# EAGLE schematic alu4 (EAGLE 7.6.0)
ALU

## Sheet 1 of 10: Accum Reg
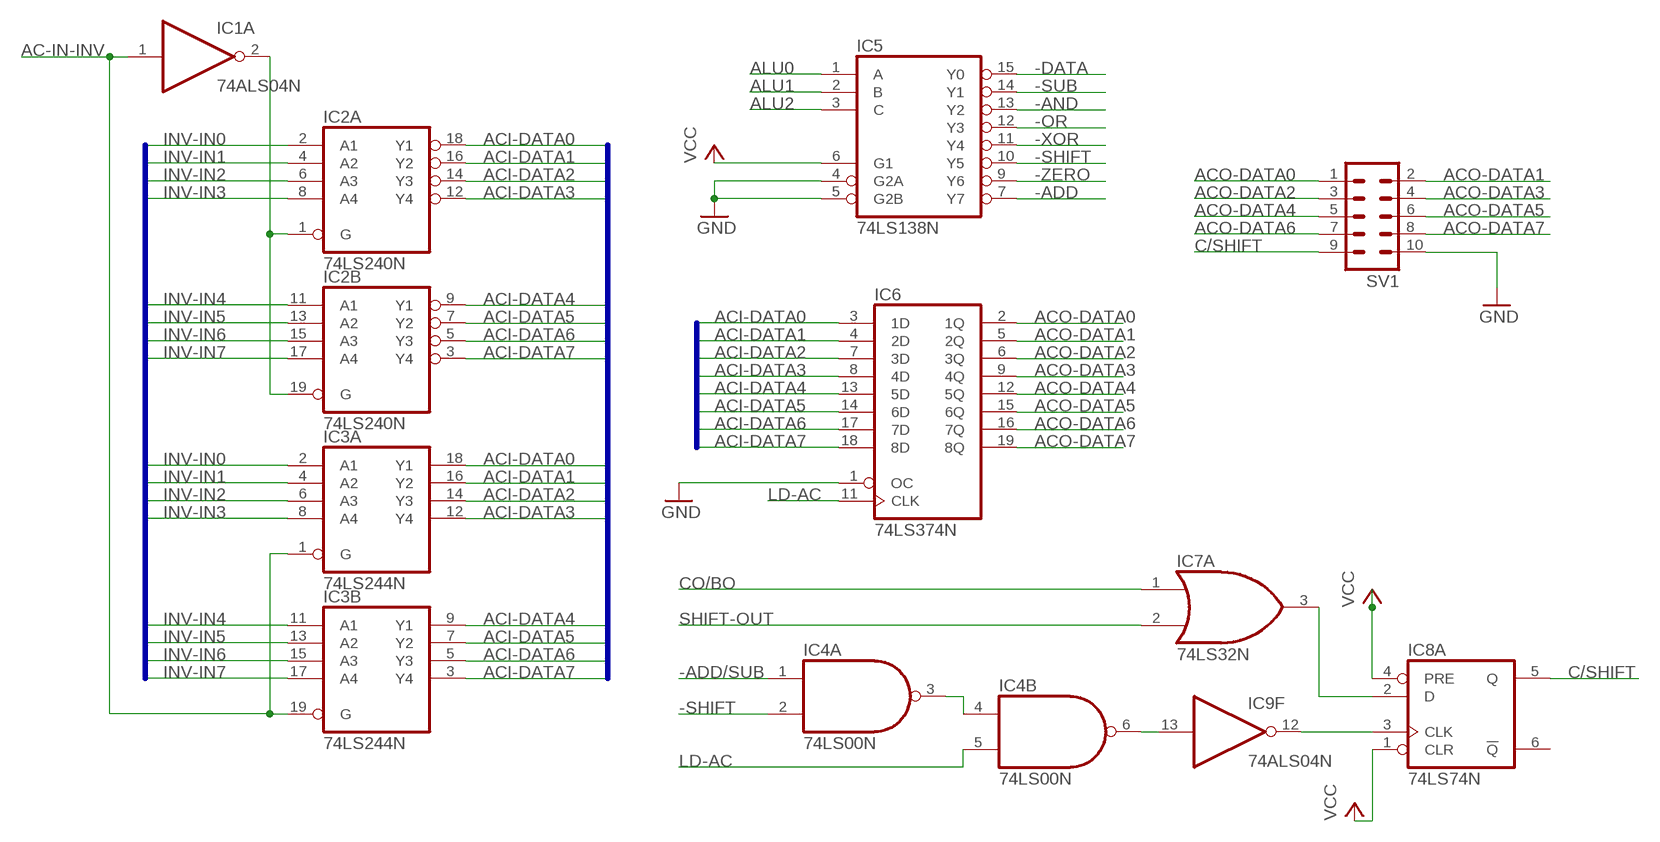
[diagram p0: schematic, sheet 1]

### Parts
IC1  74ALS04N  [DIL14]
IC2  74LS240N  [DIL20]
IC3  74LS244N  [DIL20]
IC4  74LS00N  [DIL14]
IC5  74LS138N  [DIL16]
IC6  74LS374N  [DIL20]
IC7  74LS32N  [DIL14]
IC8  74LS74N  [DIL14]
IC9  74ALS04N  [DIL14]
SV1  MA05-2  [MA05-2]

### Nets
-ADD: IC5.7(Y7) ; also sheet 8
-ADD/SUB: IC4.1(A:I0) ; also sheet 8
-AND: IC5.13(Y2) ; also sheet 5
-DATA: IC5.15(Y0) ; also sheet 4
-OR: IC5.12(Y3) ; also sheet 5
-SHIFT: IC4.2(A:I1) IC5.10(Y5) ; also sheet 7
-SUB: IC5.14(Y1) ; also sheet 8
-XOR: IC5.11(Y4) ; also sheet 5
-ZERO: IC5.9(Y6) ; also sheet 5
AC-IN-INV: IC1.1(A:I) IC3.1(A:G) IC3.19(B:G) ; also sheet 6,9
ACI-DATA0: IC2.18(A:Y1) IC3.18(A:Y1) IC6.3(1D)
ACI-DATA1: IC2.16(A:Y2) IC3.16(A:Y2) IC6.4(2D)
ACI-DATA2: IC2.14(A:Y3) IC3.14(A:Y3) IC6.7(3D)
ACI-DATA3: IC2.12(A:Y4) IC3.12(A:Y4) IC6.8(4D)
ACI-DATA4: IC2.9(B:Y1) IC3.9(B:Y1) IC6.13(5D)
ACI-DATA5: IC2.7(B:Y2) IC3.7(B:Y2) IC6.14(6D)
ACI-DATA6: IC2.5(B:Y3) IC3.5(B:Y3) IC6.17(7D)
ACI-DATA7: IC2.3(B:Y4) IC3.3(B:Y4) IC6.18(8D)
ACO-DATA0: IC6.2(1Q) SV1.1 ; also sheet 4,5,6,7,8
ACO-DATA1: IC6.5(2Q) SV1.2 ; also sheet 4,5,6,7,8
ACO-DATA2: IC6.6(3Q) SV1.3 ; also sheet 4,5,6,7,8
ACO-DATA3: IC6.9(4Q) SV1.4 ; also sheet 4,5,6,7,8
ACO-DATA4: IC6.12(5Q) SV1.5 ; also sheet 4,5,6,7,8
ACO-DATA5: IC6.15(6Q) SV1.6 ; also sheet 4,5,6,7,8
ACO-DATA6: IC6.16(7Q) SV1.7 ; also sheet 4,5,6,7,8
ACO-DATA7: IC6.19(8Q) SV1.8 ; also sheet 4,5,6,7,8
ALU0: IC5.1(A) ; also sheet 6,7,9
ALU1: IC5.2(B) ; also sheet 6,7,9
ALU2: IC5.3(C) ; also sheet 6,7,9
C/SHIFT: IC8.5(A:Q) SV1.9 ; also sheet 6,7,8
CO/BO: IC7.1(A:I0) ; also sheet 8
GND: IC5.4(G2A) IC5.5(G2B) IC6.1(OC) SV1.10 ; also sheet 2,5,6,7,9,10
INV-IN0: IC2.2(A:A1) IC3.2(A:A1) ; also sheet 4,5,7,8
INV-IN1: IC2.4(A:A2) IC3.4(A:A2) ; also sheet 4,5,7,8
INV-IN2: IC2.6(A:A3) IC3.6(A:A3) ; also sheet 4,5,7,8
INV-IN3: IC2.8(A:A4) IC3.8(A:A4) ; also sheet 4,5,7,8
INV-IN4: IC2.11(B:A1) IC3.11(B:A1) ; also sheet 4,5,7,8
INV-IN5: IC2.13(B:A2) IC3.13(B:A2) ; also sheet 4,5,7,8
INV-IN6: IC2.15(B:A3) IC3.15(B:A3) ; also sheet 4,5,7,8
INV-IN7: IC2.17(B:A4) IC3.17(B:A4) ; also sheet 4,5,7,8
LD-AC: IC4.5(B:I1) IC6.11(CLK) ; also sheet 9
N$3: IC4.3(A:O) IC4.4(B:I0)
N$4: IC4.6(B:O) IC9.13(F:I)
N$5: IC8.3(A:CLK) IC9.12(F:O)
N$7: IC7.3(A:O) IC8.2(A:D)
N$42: IC1.2(A:O) IC2.1(A:G) IC2.19(B:G)
SHIFT-OUT: IC7.2(A:I1) ; also sheet 7
VCC: IC5.6(G1) IC8.1(A:CLR) IC8.4(A:PRE) ; also sheet 2,6,7,9
Unconnected: IC8.6(A:!Q)

### Buses
INV-IN[0..7]
ACI-DATA[0..7]

## Sheet 2 of 10: caps & pullups
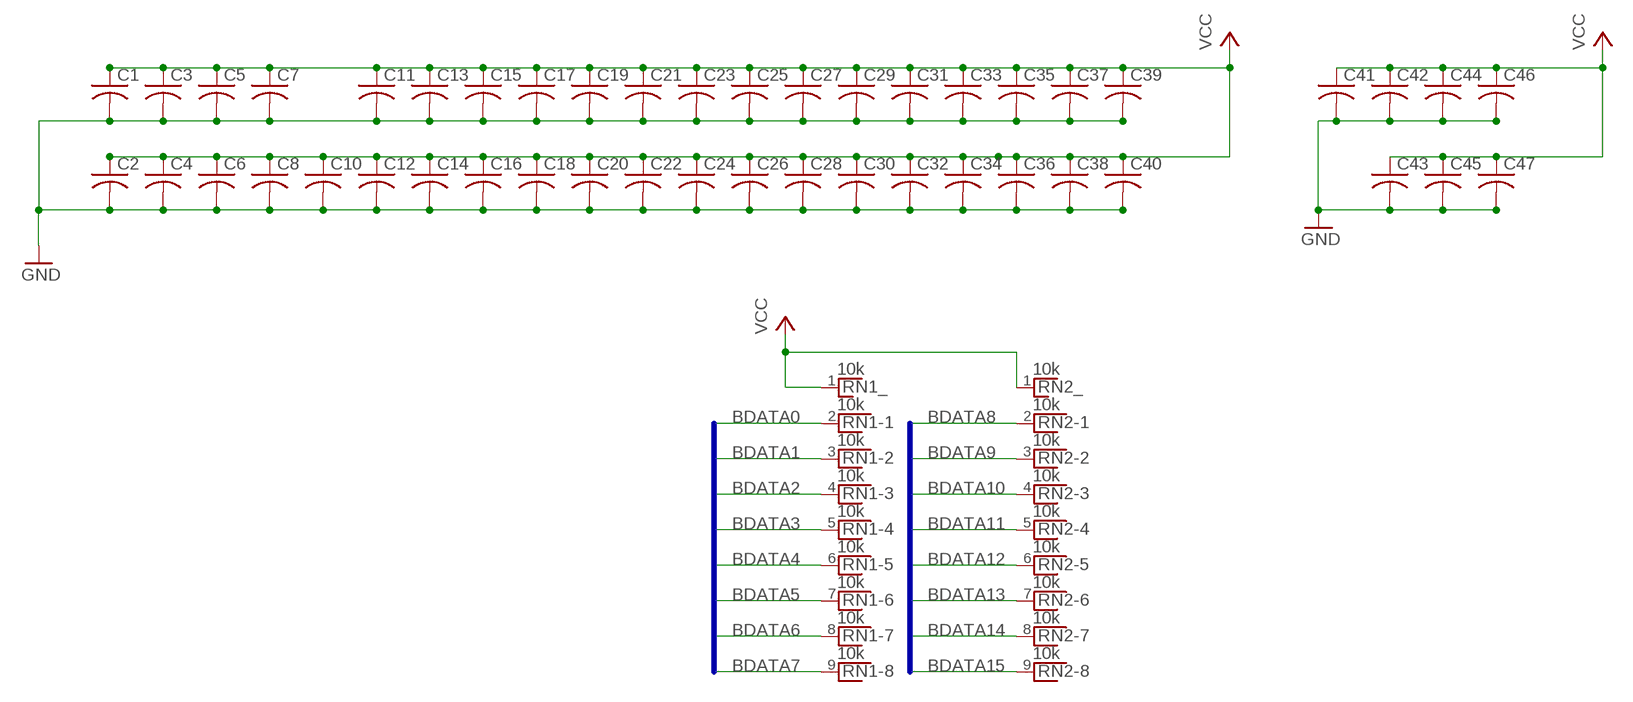
[diagram p1: schematic, sheet 2]

### Parts
C1  C-US025-024X044  [C025-024X044]
C2  C-US025-024X044  [C025-024X044]
C3  C-US025-024X044  [C025-024X044]
C4  C-US025-024X044  [C025-024X044]
C5  C-US025-024X044  [C025-024X044]
C6  C-US025-024X044  [C025-024X044]
C7  C-US025-024X044  [C025-024X044]
C8  C-US025-024X044  [C025-024X044]
C10  C-US025-024X044  [C025-024X044]
C11  C-US025-024X044  [C025-024X044]
C12  C-US025-024X044  [C025-024X044]
C13  C-US025-024X044  [C025-024X044]
C14  C-US025-024X044  [C025-024X044]
C15  C-US025-024X044  [C025-024X044]
C16  C-US025-024X044  [C025-024X044]
C17  C-US025-024X044  [C025-024X044]
C18  C-US025-024X044  [C025-024X044]
C19  C-US025-024X044  [C025-024X044]
C20  C-US025-024X044  [C025-024X044]
C21  C-US025-024X044  [C025-024X044]
C22  C-US025-024X044  [C025-024X044]
C23  C-US025-024X044  [C025-024X044]
C24  C-US025-024X044  [C025-024X044]
C25  C-US025-024X044  [C025-024X044]
C26  C-US025-024X044  [C025-024X044]
C27  C-US025-024X044  [C025-024X044]
C28  C-US025-024X044  [C025-024X044]
C29  C-US025-024X044  [C025-024X044]
C30  C-US025-024X044  [C025-024X044]
C31  C-US025-024X044  [C025-024X044]
C32  C-US025-024X044  [C025-024X044]
C33  C-US025-024X044  [C025-024X044]
C34  C-US025-024X044  [C025-024X044]
C35  C-US025-024X044  [C025-024X044]
C36  C-US025-024X044  [C025-024X044]
C37  C-US025-024X044  [C025-024X044]
C38  C-US025-024X044  [C025-024X044]
C39  C-US025-024X044  [C025-024X044]
C40  C-US025-024X044  [C025-024X044]
C41  C-US025-024X044  [C025-024X044]
C42  C-US025-024X044  [C025-024X044]
C43  C-US025-024X044  [C025-024X044]
C44  C-US025-024X044  [C025-024X044]
C45  C-US025-024X044  [C025-024X044]
C46  C-US025-024X044  [C025-024X044]
C47  C-US025-024X044  [C025-024X044]
RN1  10k  RNX8  [RN-9]
RN2  10k  RNX8  [RN-9]

### Nets
BDATA0: RN1.2 ; also sheet 3,4,5,6,8
BDATA1: RN1.3 ; also sheet 3,4,5,6,8
BDATA2: RN1.4 ; also sheet 3,4,5,6,8
BDATA3: RN1.5 ; also sheet 3,4,5,6,8
BDATA4: RN1.6 ; also sheet 3,4,5,6,8
BDATA5: RN1.7 ; also sheet 3,4,5,6,8
BDATA6: RN1.8 ; also sheet 3,4,5,6,8
BDATA7: RN1.9 ; also sheet 3,4,5,6,8
BDATA8: RN2.2 ; also sheet 3,4,6
BDATA9: RN2.3 ; also sheet 3,4,6
BDATA10: RN2.4 ; also sheet 3,4,6
BDATA11: RN2.5 ; also sheet 3,4,6
BDATA12: RN2.6 ; also sheet 3,4,6
BDATA13: RN2.7 ; also sheet 3,4,6
BDATA14: RN2.8 ; also sheet 3,4,6
BDATA15: RN2.9 ; also sheet 3,4,6
GND: C1.2 C2.2 C3.2 C4.2 C5.2 C6.2 C7.2 C8.2 C10.2 C11.2 C12.2 C13.2 C14.2 C15.2 C16.2 C17.2 C18.2 C19.2 C20.2 C21.2 C22.2 C23.2 C24.2 C25.2 C26.2 C27.2 C28.2 C29.2 C30.2 C31.2 C32.2 C33.2 C34.2 C35.2 C36.2 C37.2 C38.2 C39.2 C40.2 C41.2 C42.2 C43.2 C44.2 C45.2 C46.2 C47.2 ; also sheet 1,5,6,7,9,10
VCC: C1.1 C2.1 C3.1 C4.1 C5.1 C6.1 C7.1 C8.1 C10.1 C11.1 C12.1 C13.1 C14.1 C15.1 C16.1 C17.1 C18.1 C19.1 C20.1 C21.1 C22.1 C23.1 C24.1 C25.1 C26.1 C27.1 C28.1 C29.1 C30.1 C31.1 C32.1 C33.1 C34.1 C35.1 C36.1 C37.1 C38.1 C39.1 C40.1 C41.1 C42.1 C43.1 C44.1 C45.1 C46.1 C47.1 RN1.1 RN2.1 ; also sheet 1,6,7,9

### Buses
BDATA[0..15]

## Sheet 3 of 10: Reg INC/DEC
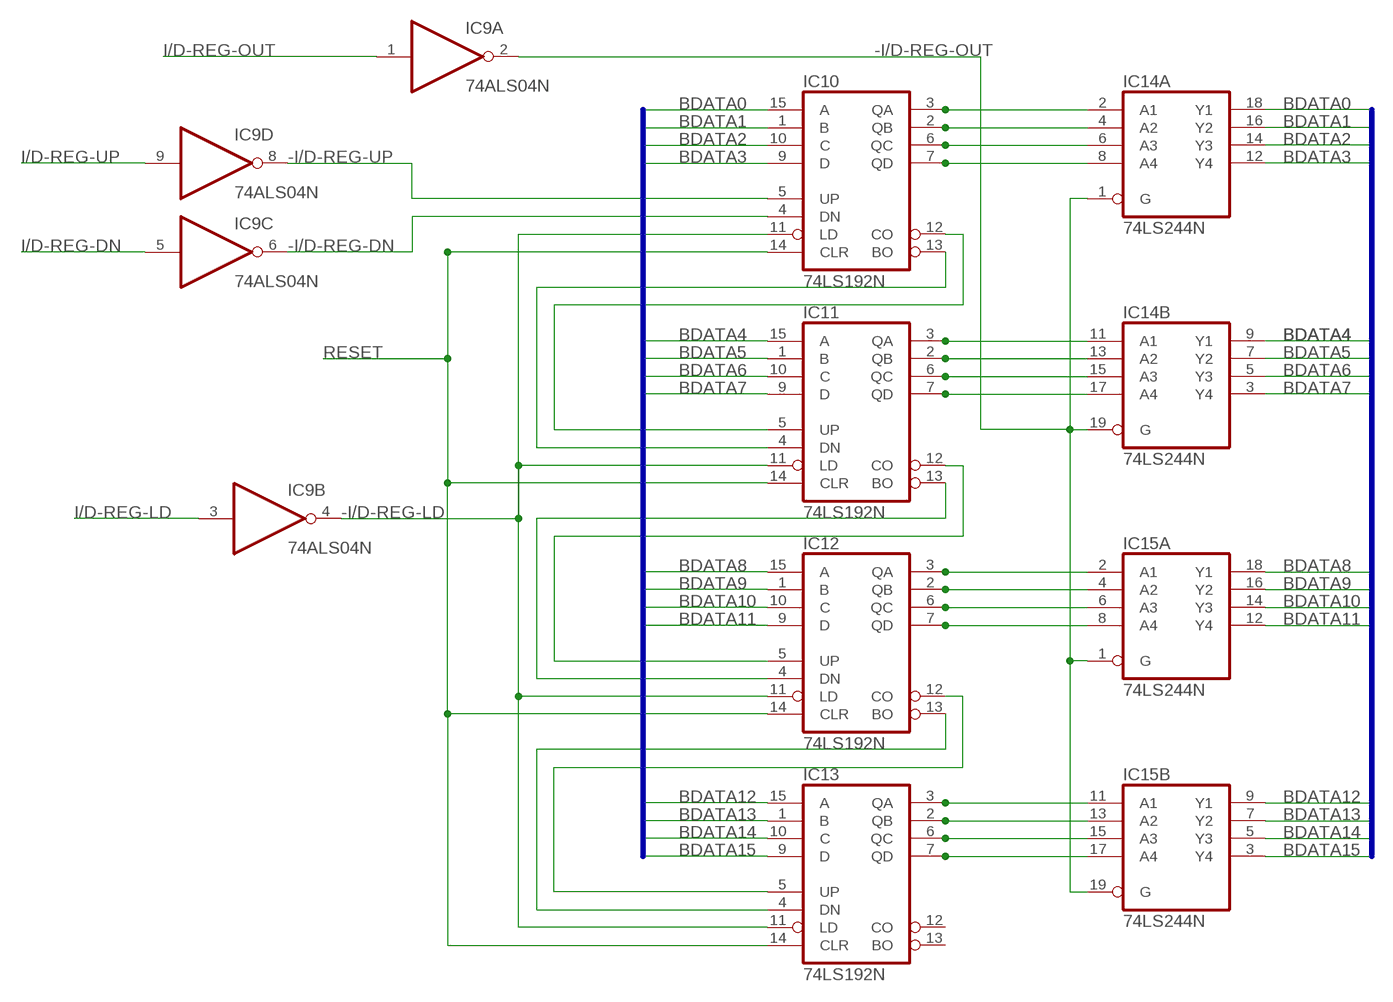
[diagram p2: schematic, sheet 3]

### Parts
IC10  74LS192N  [DIL16]
IC11  74LS192N  [DIL16]
IC12  74LS192N  [DIL16]
IC13  74LS192N  [DIL16]
IC14  74LS244N  [DIL20]
IC15  74LS244N  [DIL20]

### Nets
-I/D-REG-DN: IC9.6(C:O) IC10.4(DN)
-I/D-REG-LD: IC9.4(B:O) IC10.11(LD) IC11.11(LD) IC12.11(LD) IC13.11(LD)
-I/D-REG-OUT: IC9.2(A:O) IC14.1(A:G) IC14.19(B:G) IC15.1(A:G) IC15.19(B:G)
-I/D-REG-UP: IC9.8(D:O) IC10.5(UP)
BDATA0: IC10.15(A) IC14.18(A:Y1) ; also sheet 2,4,5,6,8
BDATA1: IC10.1(B) IC14.16(A:Y2) ; also sheet 2,4,5,6,8
BDATA2: IC10.10(C) IC14.14(A:Y3) ; also sheet 2,4,5,6,8
BDATA3: IC10.9(D) IC14.12(A:Y4) ; also sheet 2,4,5,6,8
BDATA4: IC11.15(A) IC14.9(B:Y1) ; also sheet 2,4,5,6,8
BDATA5: IC11.1(B) IC14.7(B:Y2) ; also sheet 2,4,5,6,8
BDATA6: IC11.10(C) IC14.5(B:Y3) ; also sheet 2,4,5,6,8
BDATA7: IC11.9(D) IC14.3(B:Y4) ; also sheet 2,4,5,6,8
BDATA8: IC12.15(A) IC15.18(A:Y1) ; also sheet 2,4,6
BDATA9: IC12.1(B) IC15.16(A:Y2) ; also sheet 2,4,6
BDATA10: IC12.10(C) IC15.14(A:Y3) ; also sheet 2,4,6
BDATA11: IC12.9(D) IC15.12(A:Y4) ; also sheet 2,4,6
BDATA12: IC13.15(A) IC15.9(B:Y1) ; also sheet 2,4,6
BDATA13: IC13.1(B) IC15.7(B:Y2) ; also sheet 2,4,6
BDATA14: IC13.10(C) IC15.5(B:Y3) ; also sheet 2,4,6
BDATA15: IC13.9(D) IC15.3(B:Y4) ; also sheet 2,4,6
I/D-REG-DN: IC9.5(C:I) ; also sheet 9
I/D-REG-LD: IC9.3(B:I) ; also sheet 9
I/D-REG-OUT: IC9.1(A:I) ; also sheet 4,9
I/D-REG-UP: IC9.9(D:I) ; also sheet 9
N$58: IC10.13(BO) IC11.4(DN)
N$59: IC10.12(CO) IC11.5(UP)
N$60: IC11.13(BO) IC12.4(DN)
N$61: IC11.12(CO) IC12.5(UP)
N$62: IC12.13(BO) IC13.4(DN)
N$63: IC12.12(CO) IC13.5(UP)
R1D0: IC10.7(QD) IC14.8(A:A4)
R1D1: IC10.6(QC) IC14.6(A:A3)
R1D2: IC10.2(QB) IC14.4(A:A2)
R1D3: IC10.3(QA) IC14.2(A:A1)
R1D4: IC11.7(QD) IC14.17(B:A4)
R1D5: IC11.6(QC) IC14.15(B:A3)
R1D6: IC11.2(QB) IC14.13(B:A2)
R1D7: IC11.3(QA) IC14.11(B:A1)
R1D8: IC12.7(QD) IC15.8(A:A4)
R1D9: IC12.6(QC) IC15.6(A:A3)
R1D10: IC12.2(QB) IC15.4(A:A2)
R1D11: IC12.3(QA) IC15.2(A:A1)
R1D12: IC13.7(QD) IC15.17(B:A4)
R1D13A: IC13.6(QC) IC15.15(B:A3)
R1D14: IC13.2(QB) IC15.13(B:A2)
R1D15: IC13.3(QA) IC15.11(B:A1)
RESET: IC10.14(CLR) IC11.14(CLR) IC12.14(CLR) IC13.14(CLR) ; also sheet 9
Unconnected: IC13.12(CO) IC13.13(BO)

### Buses
BDATA[0..15]

## Sheet 4 of 10: Bus Buffering
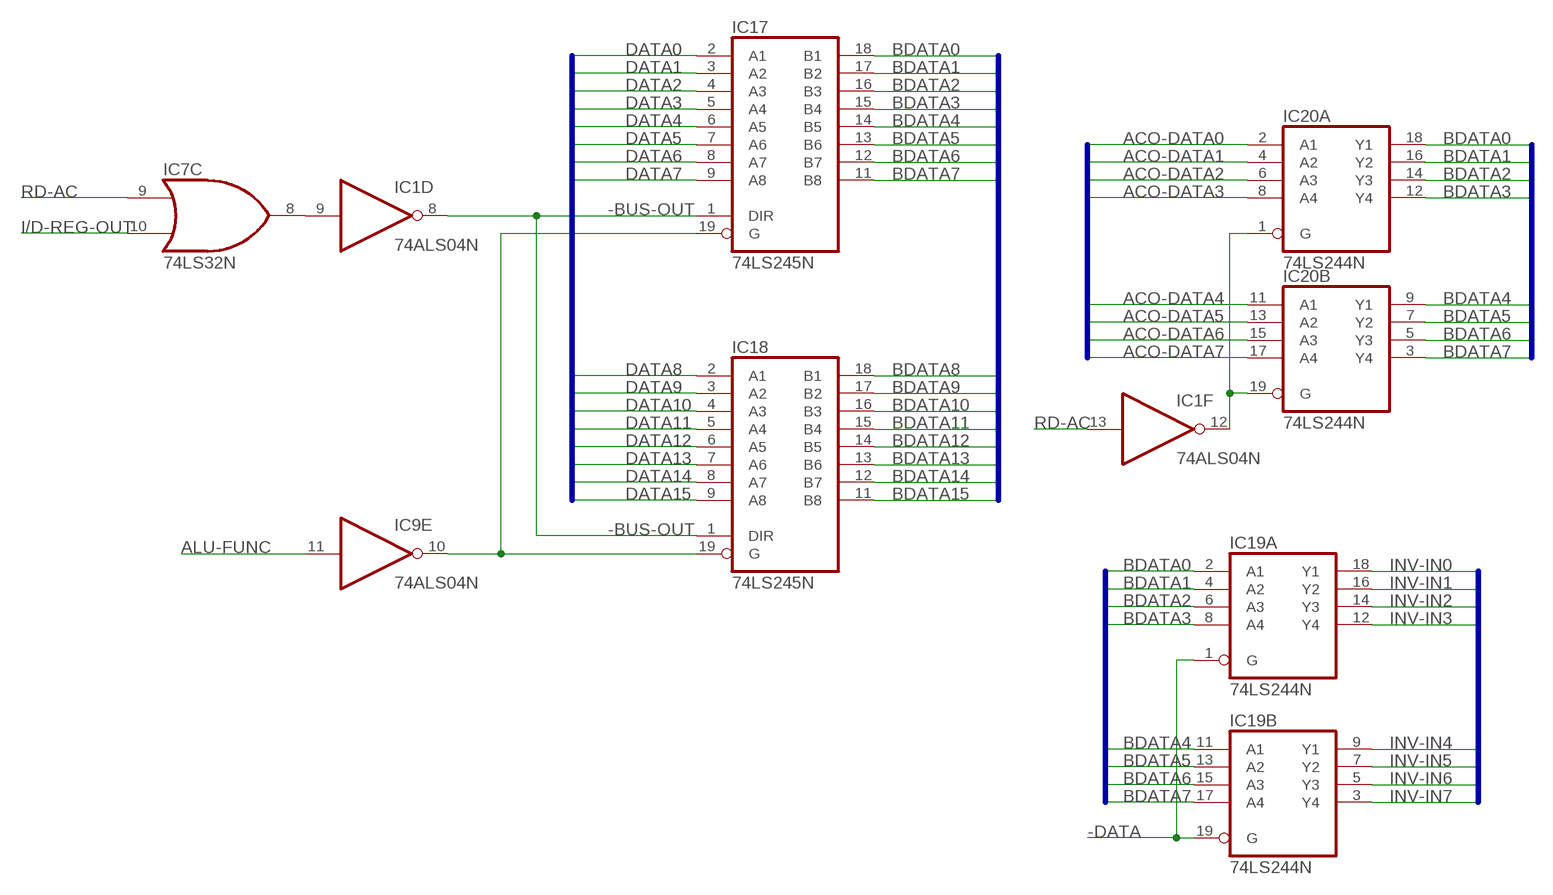
[diagram p3: schematic, sheet 4]

### Parts
IC17  74LS245N  [DIL20]
IC18  74LS245N  [DIL20]
IC19  74LS244N  [DIL20]
IC20  74LS244N  [DIL20]

### Nets
-BUS-OUT: IC1.8(D:O) IC17.1(DIR) IC18.1(DIR)
-DATA: IC19.1(A:G) IC19.19(B:G) ; also sheet 1
-RD-AC: IC1.12(F:O) IC20.1(A:G) IC20.19(B:G)
ACO-DATA0: IC20.2(A:A1) ; also sheet 1,5,6,7,8
ACO-DATA1: IC20.4(A:A2) ; also sheet 1,5,6,7,8
ACO-DATA2: IC20.6(A:A3) ; also sheet 1,5,6,7,8
ACO-DATA3: IC20.8(A:A4) ; also sheet 1,5,6,7,8
ACO-DATA4: IC20.11(B:A1) ; also sheet 1,5,6,7,8
ACO-DATA5: IC20.13(B:A2) ; also sheet 1,5,6,7,8
ACO-DATA6: IC20.15(B:A3) ; also sheet 1,5,6,7,8
ACO-DATA7: IC20.17(B:A4) ; also sheet 1,5,6,7,8
ALU-FUNC: IC9.11(E:I) ; also sheet 9
BDATA0: IC17.18(B1) IC19.2(A:A1) IC20.18(A:Y1) ; also sheet 2,3,5,6,8
BDATA1: IC17.17(B2) IC19.4(A:A2) IC20.16(A:Y2) ; also sheet 2,3,5,6,8
BDATA2: IC17.16(B3) IC19.6(A:A3) IC20.14(A:Y3) ; also sheet 2,3,5,6,8
BDATA3: IC17.15(B4) IC19.8(A:A4) IC20.12(A:Y4) ; also sheet 2,3,5,6,8
BDATA4: IC17.14(B5) IC19.11(B:A1) IC20.9(B:Y1) ; also sheet 2,3,5,6,8
BDATA5: IC17.13(B6) IC19.13(B:A2) IC20.7(B:Y2) ; also sheet 2,3,5,6,8
BDATA6: IC17.12(B7) IC19.15(B:A3) IC20.5(B:Y3) ; also sheet 2,3,5,6,8
BDATA7: IC17.11(B8) IC19.17(B:A4) IC20.3(B:Y4) ; also sheet 2,3,5,6,8
BDATA8: IC18.18(B1) ; also sheet 2,3,6
BDATA9: IC18.17(B2) ; also sheet 2,3,6
BDATA10: IC18.16(B3) ; also sheet 2,3,6
BDATA11: IC18.15(B4) ; also sheet 2,3,6
BDATA12: IC18.14(B5) ; also sheet 2,3,6
BDATA13: IC18.13(B6) ; also sheet 2,3,6
BDATA14: IC18.12(B7) ; also sheet 2,3,6
BDATA15: IC18.11(B8) ; also sheet 2,3,6
DATA0: IC17.2(A1) ; also sheet 9
DATA1: IC17.3(A2) ; also sheet 9
DATA2: IC17.4(A3) ; also sheet 9
DATA3: IC17.5(A4) ; also sheet 9
DATA4: IC17.6(A5) ; also sheet 9
DATA5: IC17.7(A6) ; also sheet 9
DATA6: IC17.8(A7) ; also sheet 9
DATA7: IC17.9(A8) ; also sheet 9
DATA8: IC18.2(A1) ; also sheet 9
DATA9: IC18.3(A2) ; also sheet 9
DATA10: IC18.4(A3) ; also sheet 9
DATA11: IC18.5(A4) ; also sheet 9
DATA12: IC18.6(A5) ; also sheet 9
DATA13: IC18.7(A6) ; also sheet 9
DATA14: IC18.8(A7) ; also sheet 9
DATA15: IC18.9(A8) ; also sheet 9
I/D-REG-OUT: IC7.10(C:I1) ; also sheet 3,9
INV-IN0: IC19.18(A:Y1) ; also sheet 1,5,7,8
INV-IN1: IC19.16(A:Y2) ; also sheet 1,5,7,8
INV-IN2: IC19.14(A:Y3) ; also sheet 1,5,7,8
INV-IN3: IC19.12(A:Y4) ; also sheet 1,5,7,8
INV-IN4: IC19.9(B:Y1) ; also sheet 1,5,7,8
INV-IN5: IC19.7(B:Y2) ; also sheet 1,5,7,8
INV-IN6: IC19.5(B:Y3) ; also sheet 1,5,7,8
INV-IN7: IC19.3(B:Y4) ; also sheet 1,5,7,8
N$9: IC1.9(D:I) IC7.8(C:O)
N$64: IC9.10(E:O) IC17.19(G) IC18.19(G)
RD-AC: IC1.13(F:I) IC7.9(C:I0) ; also sheet 9

### Buses
BDATA[0..15]
DATA[0..15]
INV-IN[0..7]
BDATA[0..7]
ACO-DATA[0..7]

## Sheet 5 of 10: Logical
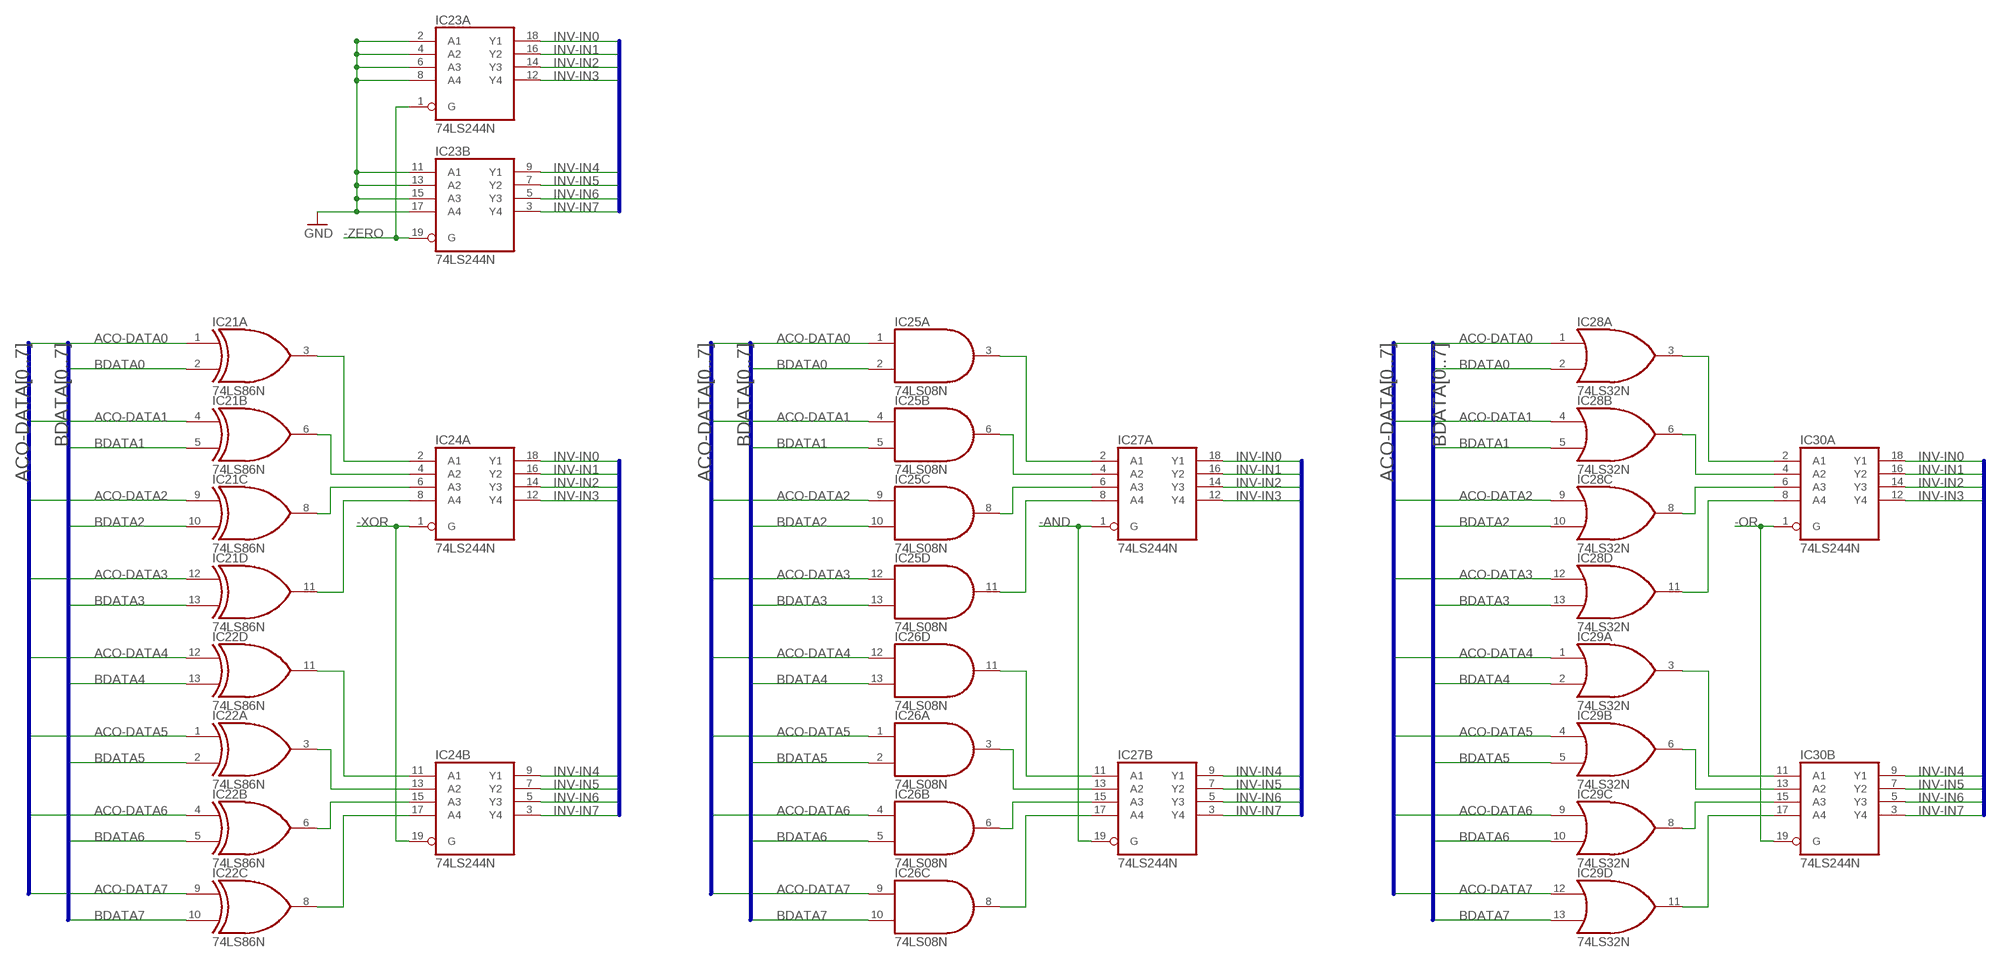
[diagram p4: schematic, sheet 5]

### Parts
IC21  74LS86N  [DIL14]
IC22  74LS86N  [DIL14]
IC23  74LS244N  [DIL20]
IC24  74LS244N  [DIL20]
IC25  74LS08N  [DIL14]
IC26  74LS08N  [DIL14]
IC27  74LS244N  [DIL20]
IC28  74LS32N  [DIL14]
IC29  74LS32N  [DIL14]
IC30  74LS244N  [DIL20]

### Nets
-AND: IC27.1(A:G) IC27.19(B:G) ; also sheet 1
-OR: IC30.1(A:G) IC30.19(B:G) ; also sheet 1
-XOR: IC24.1(A:G) IC24.19(B:G) ; also sheet 1
-ZERO: IC23.1(A:G) IC23.19(B:G) ; also sheet 1
ACO-DATA0: IC21.1(A:I0) IC25.1(A:I0) IC28.1(A:I0) ; also sheet 1,4,6,7,8
ACO-DATA1: IC21.4(B:I0) IC25.4(B:I0) IC28.4(B:I0) ; also sheet 1,4,6,7,8
ACO-DATA2: IC21.9(C:I0) IC25.9(C:I0) IC28.9(C:I0) ; also sheet 1,4,6,7,8
ACO-DATA3: IC21.12(D:I0) IC25.12(D:I0) IC28.12(D:I0) ; also sheet 1,4,6,7,8
ACO-DATA4: IC22.12(D:I0) IC26.12(D:I0) IC29.1(A:I0) ; also sheet 1,4,6,7,8
ACO-DATA5: IC22.1(A:I0) IC26.1(A:I0) IC29.4(B:I0) ; also sheet 1,4,6,7,8
ACO-DATA6: IC22.4(B:I0) IC26.4(B:I0) IC29.9(C:I0) ; also sheet 1,4,6,7,8
ACO-DATA7: IC22.9(C:I0) IC26.9(C:I0) IC29.12(D:I0) ; also sheet 1,4,6,7,8
BDATA0: IC21.2(A:I1) IC25.2(A:I1) IC28.2(A:I1) ; also sheet 2,3,4,6,8
BDATA1: IC21.5(B:I1) IC25.5(B:I1) IC28.5(B:I1) ; also sheet 2,3,4,6,8
BDATA2: IC21.10(C:I1) IC25.10(C:I1) IC28.10(C:I1) ; also sheet 2,3,4,6,8
BDATA3: IC21.13(D:I1) IC25.13(D:I1) IC28.13(D:I1) ; also sheet 2,3,4,6,8
BDATA4: IC22.13(D:I1) IC26.13(D:I1) IC29.2(A:I1) ; also sheet 2,3,4,6,8
BDATA5: IC22.2(A:I1) IC26.2(A:I1) IC29.5(B:I1) ; also sheet 2,3,4,6,8
BDATA6: IC22.5(B:I1) IC26.5(B:I1) IC29.10(C:I1) ; also sheet 2,3,4,6,8
BDATA7: IC22.10(C:I1) IC26.10(C:I1) IC29.13(D:I1) ; also sheet 2,3,4,6,8
GND: IC23.2(A:A1) IC23.4(A:A2) IC23.6(A:A3) IC23.8(A:A4) IC23.11(B:A1) IC23.13(B:A2) IC23.15(B:A3) IC23.17(B:A4) ; also sheet 1,2,6,7,9,10
INV-IN0: IC23.18(A:Y1) IC24.18(A:Y1) IC27.18(A:Y1) IC30.18(A:Y1) ; also sheet 1,4,7,8
INV-IN1: IC23.16(A:Y2) IC24.16(A:Y2) IC27.16(A:Y2) IC30.16(A:Y2) ; also sheet 1,4,7,8
INV-IN2: IC23.14(A:Y3) IC24.14(A:Y3) IC27.14(A:Y3) IC30.14(A:Y3) ; also sheet 1,4,7,8
INV-IN3: IC23.12(A:Y4) IC24.12(A:Y4) IC27.12(A:Y4) IC30.12(A:Y4) ; also sheet 1,4,7,8
INV-IN4: IC23.9(B:Y1) IC24.9(B:Y1) IC27.9(B:Y1) IC30.9(B:Y1) ; also sheet 1,4,7,8
INV-IN5: IC23.7(B:Y2) IC24.7(B:Y2) IC27.7(B:Y2) IC30.7(B:Y2) ; also sheet 1,4,7,8
INV-IN6: IC23.5(B:Y3) IC24.5(B:Y3) IC27.5(B:Y3) IC30.5(B:Y3) ; also sheet 1,4,7,8
INV-IN7: IC23.3(B:Y4) IC24.3(B:Y4) IC27.3(B:Y4) IC30.3(B:Y4) ; also sheet 1,4,7,8
N$77: IC28.3(A:O) IC30.2(A:A1)
N$78: IC28.6(B:O) IC30.4(A:A2)
N$79: IC28.8(C:O) IC30.6(A:A3)
N$81: IC28.11(D:O) IC30.8(A:A4)
N$82: IC29.3(A:O) IC30.11(B:A1)
N$83: IC29.6(B:O) IC30.13(B:A2)
N$84: IC29.8(C:O) IC30.15(B:A3)
N$85: IC29.11(D:O) IC30.17(B:A4)
N$86: IC25.3(A:O) IC27.2(A:A1)
N$87: IC25.6(B:O) IC27.4(A:A2)
N$88: IC25.8(C:O) IC27.6(A:A3)
N$89: IC25.11(D:O) IC27.8(A:A4)
N$90: IC26.11(D:O) IC27.11(B:A1)
N$91: IC26.3(A:O) IC27.13(B:A2)
N$92: IC26.6(B:O) IC27.15(B:A3)
N$93: IC26.8(C:O) IC27.17(B:A4)
N$94: IC21.3(A:O) IC24.2(A:A1)
N$95: IC21.6(B:O) IC24.4(A:A2)
N$96: IC21.8(C:O) IC24.6(A:A3)
N$97: IC21.11(D:O) IC24.8(A:A4)
N$98: IC22.11(D:O) IC24.11(B:A1)
N$99: IC22.3(A:O) IC24.13(B:A2)
N$100: IC22.6(B:O) IC24.15(B:A3)
N$101: IC22.8(C:O) IC24.17(B:A4)

### Buses
INV-IN[0..7]
ACO-DATA[0..7]
BDATA[0..7]

## Sheet 6 of 10: Compare
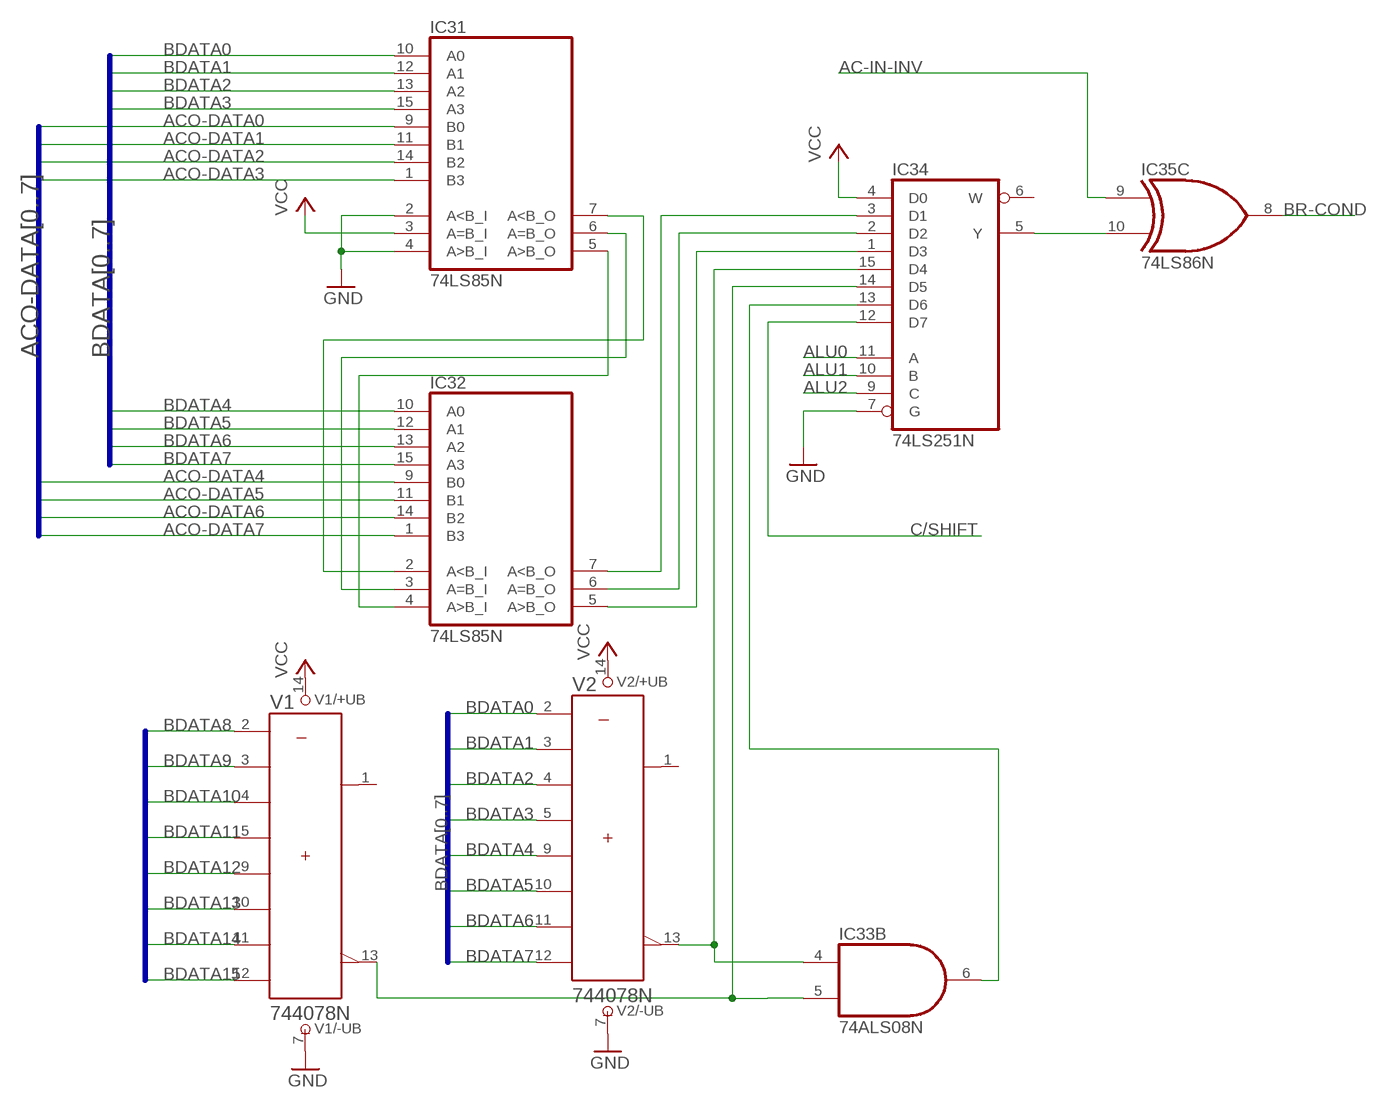
[diagram p5: schematic, sheet 6]

### Parts
IC31  74LS85N  [DIL16]
IC32  74LS85N  [DIL16]
IC33  74ALS08N  [DIL14]
IC34  74LS251N  [DIL16]
IC35  74LS86N  [DIL14]
V1  744078N  [DIL14]
V2  744078N  [DIL14]

### Nets
AC-IN-INV: IC35.9(C:I0) ; also sheet 1,9
ACO-DATA0: IC31.9(B0) ; also sheet 1,4,5,7,8
ACO-DATA1: IC31.11(B1) ; also sheet 1,4,5,7,8
ACO-DATA2: IC31.14(B2) ; also sheet 1,4,5,7,8
ACO-DATA3: IC31.1(B3) ; also sheet 1,4,5,7,8
ACO-DATA4: IC32.9(B0) ; also sheet 1,4,5,7,8
ACO-DATA5: IC32.11(B1) ; also sheet 1,4,5,7,8
ACO-DATA6: IC32.14(B2) ; also sheet 1,4,5,7,8
ACO-DATA7: IC32.1(B3) ; also sheet 1,4,5,7,8
ALU0: IC34.11(A) ; also sheet 1,7,9
ALU1: IC34.10(B) ; also sheet 1,7,9
ALU2: IC34.9(C) ; also sheet 1,7,9
BDATA0: IC31.10(A0) V2.2(A) ; also sheet 2,3,4,5,8
BDATA1: IC31.12(A1) V2.3(B) ; also sheet 2,3,4,5,8
BDATA2: IC31.13(A2) V2.4(C) ; also sheet 2,3,4,5,8
BDATA3: IC31.15(A3) V2.5(D) ; also sheet 2,3,4,5,8
BDATA4: IC32.10(A0) V2.9(E) ; also sheet 2,3,4,5,8
BDATA5: IC32.12(A1) V2.10(F) ; also sheet 2,3,4,5,8
BDATA6: IC32.13(A2) V2.11(G) ; also sheet 2,3,4,5,8
BDATA7: IC32.15(A3) V2.12(H) ; also sheet 2,3,4,5,8
BDATA8: V1.2(A) ; also sheet 2,3,4
BDATA9: V1.3(B) ; also sheet 2,3,4
BDATA10: V1.4(C) ; also sheet 2,3,4
BDATA11: V1.5(D) ; also sheet 2,3,4
BDATA12: V1.9(E) ; also sheet 2,3,4
BDATA13: V1.10(F) ; also sheet 2,3,4
BDATA14: V1.11(G) ; also sheet 2,3,4
BDATA15: V1.12(H) ; also sheet 2,3,4
BR-COND: IC35.8(C:O) ; also sheet 9
C/SHIFT: IC34.12(D7) ; also sheet 1,7,8
GND: IC31.2(A<B_I) IC31.4(A>B_I) IC34.7(G) V1.7(-UB) V2.7(-UB) ; also sheet 1,2,5,7,9,10
N$6: IC33.4(B:I0) IC34.15(D4) V2.13(W)
N$43: IC31.5(A>B_O) IC32.4(A>B_I)
N$45: IC31.6(A=B_O) IC32.3(A=B_I)
N$46: IC31.7(A<B_O) IC32.2(A<B_I)
N$47: IC32.7(A<B_O) IC34.3(D1)
N$48: IC32.6(A=B_O) IC34.2(D2)
N$49: IC32.5(A>B_O) IC34.1(D3)
N$52: IC33.5(B:I1) IC34.14(D5) V1.13(W)
N$55: IC33.6(B:O) IC34.13(D6)
N$56: IC34.5(Y) IC35.10(C:I1)
VCC: IC31.3(A=B_I) IC34.4(D0) V1.14(+UB) V2.14(+UB) ; also sheet 1,2,7,9
Unconnected: IC34.6(W) V1.1(Y) V2.1(Y)

### Buses
ACO-DATA[0..7]
BDATA[0..7]
BDATA[8..15]

## Sheet 7 of 10: Shifter
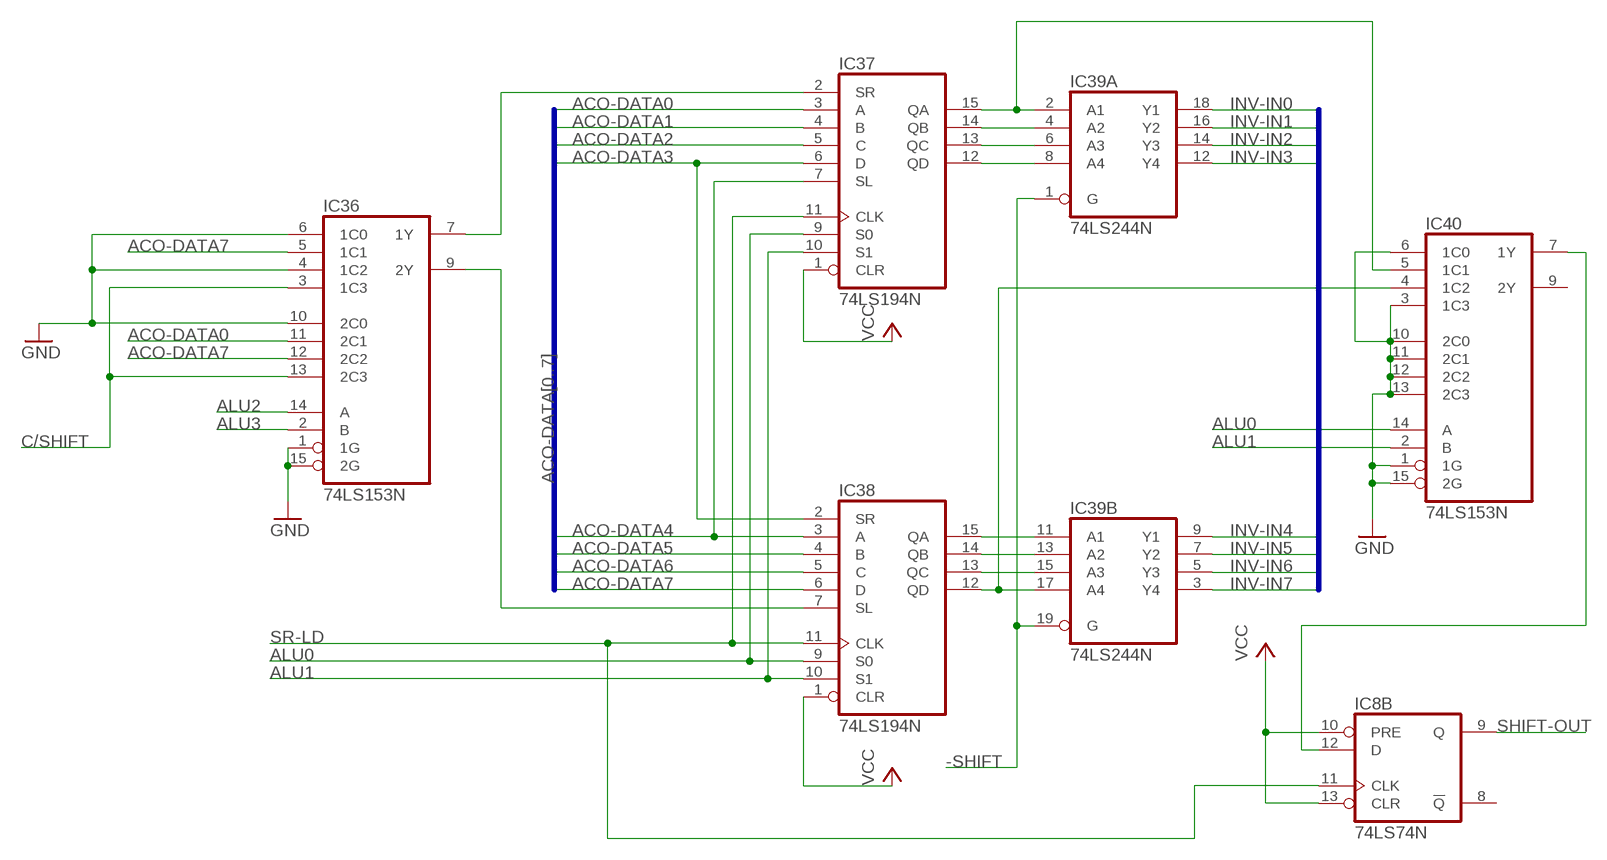
[diagram p6: schematic, sheet 7]

### Parts
IC36  74LS153N  [DIL16]
IC37  74LS194N  [DIL16]
IC38  74LS194N  [DIL16]
IC39  74LS244N  [DIL20]
IC40  74LS153N  [DIL16]

### Nets
-SHIFT: IC39.1(A:G) IC39.19(B:G) ; also sheet 1
ACO-DATA0: IC36.11(2C1) IC37.3(A) ; also sheet 1,4,5,6,8
ACO-DATA1: IC37.4(B) ; also sheet 1,4,5,6,8
ACO-DATA2: IC37.5(C) ; also sheet 1,4,5,6,8
ACO-DATA3: IC37.6(D) IC38.2(SR) ; also sheet 1,4,5,6,8
ACO-DATA4: IC37.7(SL) IC38.3(A) ; also sheet 1,4,5,6,8
ACO-DATA5: IC38.4(B) ; also sheet 1,4,5,6,8
ACO-DATA6: IC38.5(C) ; also sheet 1,4,5,6,8
ACO-DATA7: IC36.5(1C1) IC36.12(2C2) IC38.6(D) ; also sheet 1,4,5,6,8
ALU0: IC37.9(S0) IC38.9(S0) IC40.14(A) ; also sheet 1,6,9
ALU1: IC37.10(S1) IC38.10(S1) IC40.2(B) ; also sheet 1,6,9
ALU2: IC36.14(A) ; also sheet 1,6,9
ALU3: IC36.2(B) ; also sheet 8,9
C/SHIFT: IC36.3(1C3) IC36.13(2C3) ; also sheet 1,6,8
GND: IC36.1(1G) IC36.4(1C2) IC36.6(1C0) IC36.10(2C0) IC36.15(2G) IC40.1(1G) IC40.3(1C3) IC40.6(1C0) IC40.10(2C0) IC40.11(2C1) IC40.12(2C2) IC40.13(2C3) IC40.15(2G) ; also sheet 1,2,5,6,9,10
INV-IN0: IC39.18(A:Y1) ; also sheet 1,4,5,8
INV-IN1: IC39.16(A:Y2) ; also sheet 1,4,5,8
INV-IN2: IC39.14(A:Y3) ; also sheet 1,4,5,8
INV-IN3: IC39.12(A:Y4) ; also sheet 1,4,5,8
INV-IN4: IC39.9(B:Y1) ; also sheet 1,4,5,8
INV-IN5: IC39.7(B:Y2) ; also sheet 1,4,5,8
INV-IN6: IC39.5(B:Y3) ; also sheet 1,4,5,8
INV-IN7: IC39.3(B:Y4) ; also sheet 1,4,5,8
N$11: IC8.12(B:D) IC40.7(1Y)
N$57: IC37.15(QA) IC39.2(A:A1) IC40.5(1C1)
N$66: IC37.14(QB) IC39.4(A:A2)
N$69: IC37.13(QC) IC39.6(A:A3)
N$70: IC37.12(QD) IC39.8(A:A4)
N$71: IC38.15(QA) IC39.11(B:A1)
N$72: IC38.14(QB) IC39.13(B:A2)
N$73: IC38.13(QC) IC39.15(B:A3)
N$74: IC38.12(QD) IC39.17(B:A4) IC40.4(1C2)
N$75: IC36.7(1Y) IC37.2(SR)
N$76: IC36.9(2Y) IC38.7(SL)
SHIFT-OUT: IC8.9(B:Q) ; also sheet 1
SR-LD: IC8.11(B:CLK) IC37.11(CLK) IC38.11(CLK) ; also sheet 9
VCC: IC8.10(B:PRE) IC8.13(B:CLR) IC37.1(CLR) IC38.1(CLR) ; also sheet 1,2,6,9
Unconnected: IC8.8(B:!Q) IC40.9(2Y)

### Buses
INV-IN[0..7]
ACO-DATA[0..7]

## Sheet 8 of 10: Add/Sub
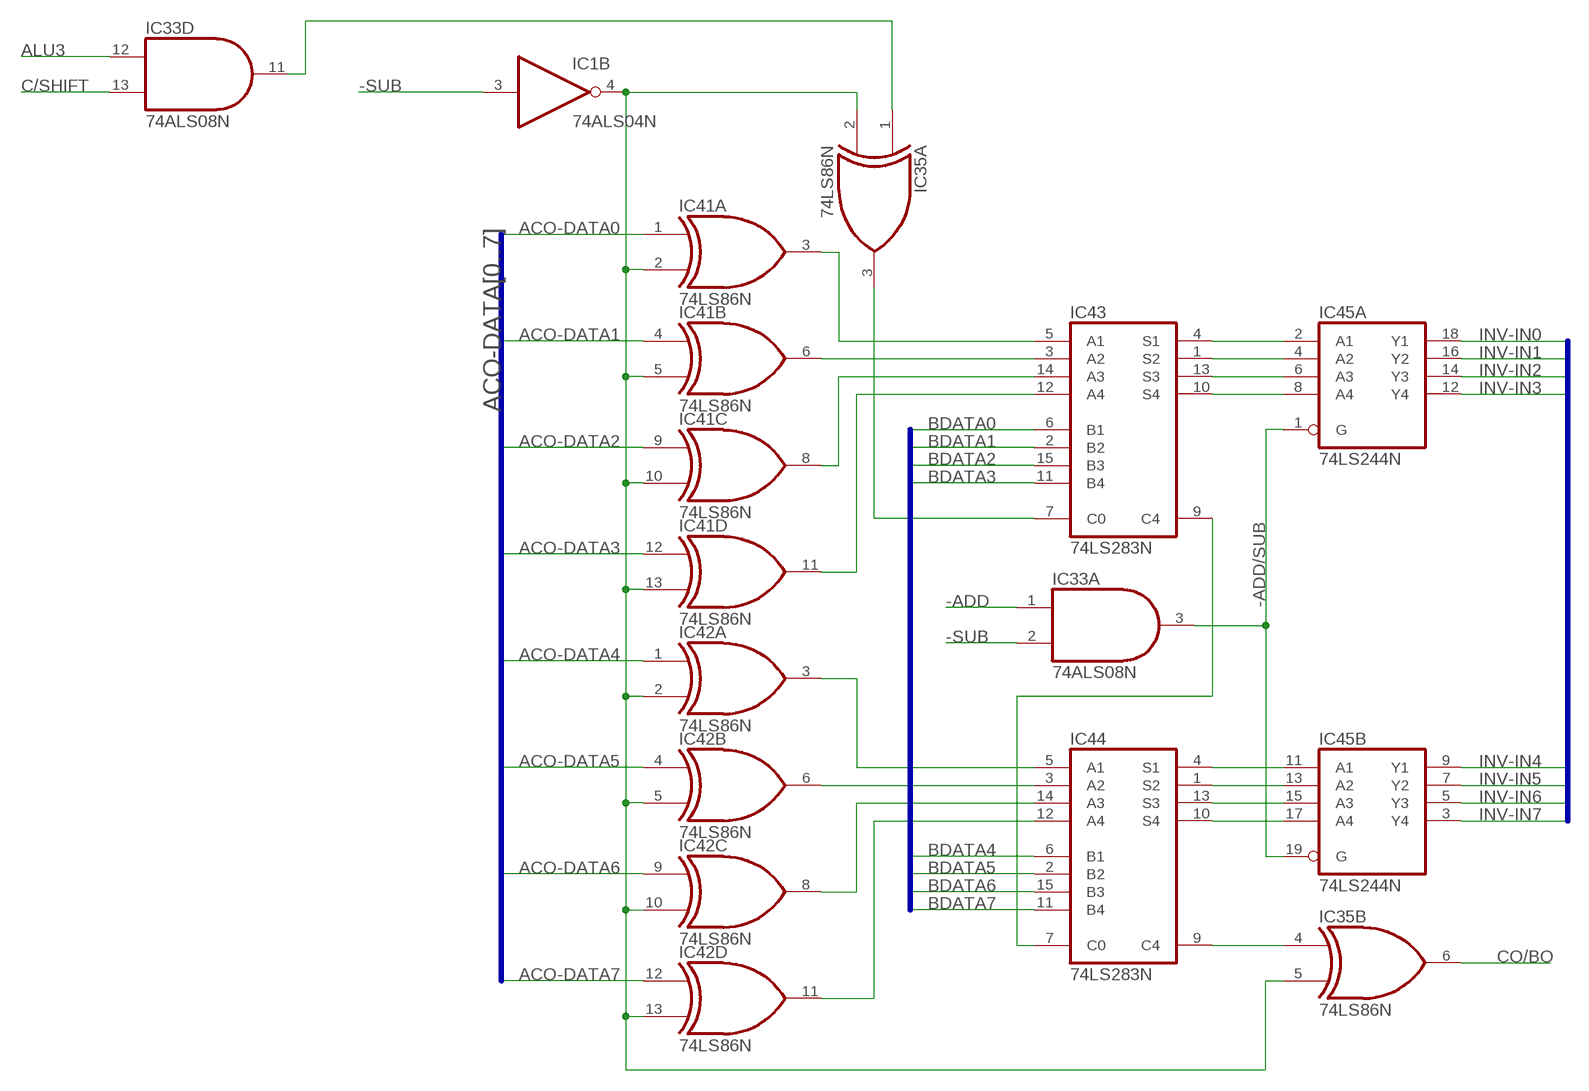
[diagram p7: schematic, sheet 8]

### Parts
IC41  74LS86N  [DIL14]
IC42  74LS86N  [DIL14]
IC43  74LS283N  [DIL16]
IC44  74LS283N  [DIL16]
IC45  74LS244N  [DIL20]

### Nets
-ADD: IC33.1(A:I0) ; also sheet 1
-ADD/SUB: IC33.3(A:O) IC45.1(A:G) IC45.19(B:G) ; also sheet 1
-SUB: IC1.3(B:I) IC33.2(A:I1) ; also sheet 1
ACO-DATA0: IC41.1(A:I0) ; also sheet 1,4,5,6,7
ACO-DATA1: IC41.4(B:I0) ; also sheet 1,4,5,6,7
ACO-DATA2: IC41.9(C:I0) ; also sheet 1,4,5,6,7
ACO-DATA3: IC41.12(D:I0) ; also sheet 1,4,5,6,7
ACO-DATA4: IC42.1(A:I0) ; also sheet 1,4,5,6,7
ACO-DATA5: IC42.4(B:I0) ; also sheet 1,4,5,6,7
ACO-DATA6: IC42.9(C:I0) ; also sheet 1,4,5,6,7
ACO-DATA7: IC42.12(D:I0) ; also sheet 1,4,5,6,7
ALU3: IC33.12(D:I0) ; also sheet 7,9
BDATA0: IC43.6(B1) ; also sheet 2,3,4,5,6
BDATA1: IC43.2(B2) ; also sheet 2,3,4,5,6
BDATA2: IC43.15(B3) ; also sheet 2,3,4,5,6
BDATA3: IC43.11(B4) ; also sheet 2,3,4,5,6
BDATA4: IC44.6(B1) ; also sheet 2,3,4,5,6
BDATA5: IC44.2(B2) ; also sheet 2,3,4,5,6
BDATA6: IC44.15(B3) ; also sheet 2,3,4,5,6
BDATA7: IC44.11(B4) ; also sheet 2,3,4,5,6
C/SHIFT: IC33.13(D:I1) ; also sheet 1,6,7
CO/BO: IC35.6(B:O) ; also sheet 1
INV-IN0: IC45.18(A:Y1) ; also sheet 1,4,5,7
INV-IN1: IC45.16(A:Y2) ; also sheet 1,4,5,7
INV-IN2: IC45.14(A:Y3) ; also sheet 1,4,5,7
INV-IN3: IC45.12(A:Y4) ; also sheet 1,4,5,7
INV-IN4: IC45.9(B:Y1) ; also sheet 1,4,5,7
INV-IN5: IC45.7(B:Y2) ; also sheet 1,4,5,7
INV-IN6: IC45.5(B:Y3) ; also sheet 1,4,5,7
INV-IN7: IC45.3(B:Y4) ; also sheet 1,4,5,7
N$1: IC35.4(B:I0) IC44.9(C4)
N$2: IC35.3(A:O) IC43.7(C0)
N$8: IC33.11(D:O) IC35.1(A:I0)
N$25: IC41.6(B:O) IC43.3(A2)
N$26: IC41.8(C:O) IC43.14(A3)
N$27: IC41.11(D:O) IC43.12(A4)
N$28: IC41.3(A:O) IC43.5(A1)
N$29: IC42.3(A:O) IC44.5(A1)
N$30: IC42.6(B:O) IC44.3(A2)
N$31: IC42.8(C:O) IC44.14(A3)
N$32: IC42.11(D:O) IC44.12(A4)
N$33: IC43.4(S1) IC45.2(A:A1)
N$34: IC43.1(S2) IC45.4(A:A2)
N$35: IC43.13(S3) IC45.6(A:A3)
N$36: IC43.10(S4) IC45.8(A:A4)
N$37: IC44.4(S1) IC45.11(B:A1)
N$38: IC44.1(S2) IC45.13(B:A2)
N$39: IC44.13(S3) IC45.15(B:A3)
N$40: IC44.10(S4) IC45.17(B:A4)
N$41: IC43.9(C4) IC44.7(C0)
SUB: IC1.4(B:O) IC35.2(A:I1) IC35.5(B:I1) IC41.2(A:I1) IC41.5(B:I1) IC41.10(C:I1) IC41.13(D:I1) IC42.2(A:I1) IC42.5(B:I1) IC42.10(C:I1) IC42.13(D:I1)

### Buses
INV-IN[0..7]
ACO-DATA[0..7]
BDATA[0..7]

## Sheet 9 of 10: bus
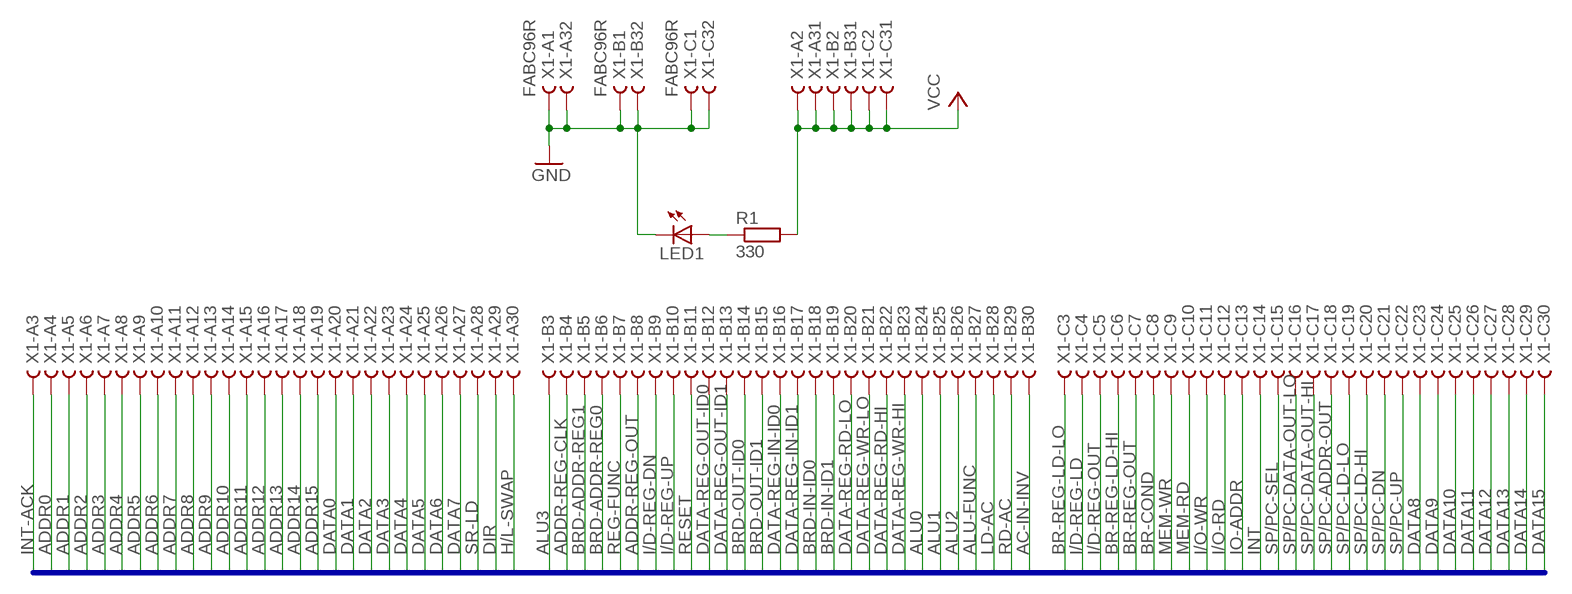
[diagram p8: schematic, sheet 9]

### Parts
LED1  LED5MM  [LED5MM]
R1  330  R0207/10  [0207/10]
X1  FABC96R  [FABC96R]

### Nets
AC-IN-INV: X1.B30 ; also sheet 1,6
ADDR0: X1.A4
ADDR1: X1.A5
ADDR2: X1.A6
ADDR3: X1.A7
ADDR4: X1.A8
ADDR5: X1.A9
ADDR6: X1.A10
ADDR7: X1.A11
ADDR8: X1.A12
ADDR9: X1.A13
ADDR10: X1.A14
ADDR11: X1.A15
ADDR12: X1.A16
ADDR13: X1.A17
ADDR14: X1.A18
ADDR15: X1.A19
ADDR-REG-CLK: X1.B4
ADDR-REG-OUT: X1.B8
ALU0: X1.B24 ; also sheet 1,6,7
ALU1: X1.B25 ; also sheet 1,6,7
ALU2: X1.B26 ; also sheet 1,6,7
ALU3: X1.B3 ; also sheet 7,8
ALU-FUNC: X1.B27 ; also sheet 4
BR-COND: X1.C8 ; also sheet 6
BR-REG-LD-HI: X1.C6
BR-REG-LD-LO: X1.C3
BR-REG-OUT: X1.C7
BRD-ADDR-REG0: X1.B6
BRD-ADDR-REG1: X1.B5
BRD-IN-ID0: X1.B18
BRD-IN-ID1: X1.B19
BRD-OUT-ID0: X1.B14
BRD-OUT-ID1: X1.B15
DATA0: X1.A20 ; also sheet 4
DATA1: X1.A21 ; also sheet 4
DATA2: X1.A22 ; also sheet 4
DATA3: X1.A23 ; also sheet 4
DATA4: X1.A24 ; also sheet 4
DATA5: X1.A25 ; also sheet 4
DATA6: X1.A26 ; also sheet 4
DATA7: X1.A27 ; also sheet 4
DATA8: X1.C23 ; also sheet 4
DATA9: X1.C24 ; also sheet 4
DATA10: X1.C25 ; also sheet 4
DATA11: X1.C26 ; also sheet 4
DATA12: X1.C27 ; also sheet 4
DATA13: X1.C28 ; also sheet 4
DATA14: X1.C29 ; also sheet 4
DATA15: X1.C30 ; also sheet 4
DATA-REG-IN-ID0: X1.B16
DATA-REG-IN-ID1: X1.B17
DATA-REG-OUT-ID0: X1.B12
DATA-REG-OUT-ID1: X1.B13
DATA-REG-RD-HI: X1.B22
DATA-REG-RD-LO: X1.B20
DATA-REG-WR-HI: X1.B23
DATA-REG-WR-LO: X1.B21
DIR: X1.A29
GND: LED1.K(C) X1.A1 X1.A32 X1.B1 X1.B32 X1.C1 X1.C32 ; also sheet 1,2,5,6,7,10
H/L-SWAP: X1.A30
I/D-REG-DN: X1.B9 ; also sheet 3
I/D-REG-LD: X1.C4 ; also sheet 3
I/D-REG-OUT: X1.C5 ; also sheet 3,4
I/D-REG-UP: X1.B10 ; also sheet 3
I/O-RD: X1.C12
I/O-WR: X1.C11
INT: X1.C14
INT-ACK: X1.A3
IO-ADDR: X1.C13
LD-AC: X1.B28 ; also sheet 1
MEM-RD: X1.C10
MEM-WR: X1.C9
N$10: LED1.A R1.1
RD-AC: X1.B29 ; also sheet 4
REG-FUNC: X1.B7
RESET: X1.B11 ; also sheet 3
SP/PC-ADDR-OUT: X1.C18
SP/PC-DATA-OUT-HI: X1.C17
SP/PC-DATA-OUT-LO: X1.C16
SP/PC-DN: X1.C21
SP/PC-LD-HI: X1.C20
SP/PC-LD-LO: X1.C19
SP/PC-SEL: X1.C15
SP/PC-UP: X1.C22
SR-LD: X1.A28 ; also sheet 7
VCC: R1.2 X1.A2 X1.A31 X1.B2 X1.B31 X1.C2 X1.C31 ; also sheet 1,2,6,7

### Buses
ADDR[0..15],DATA[0..15],SR-LD,DIR,H/L-SWAP,ADDR-REG-CLK,BRD-ADDR-REG[0..1],REG-FUNC,ADDR-REG-OUT,I/D-REG-DN,I/D-REG-UP,RESET,DATA-REG-OUT-ID[0..1],BRD-OUT-ID[0..1],DATA-REG-IN-ID[0..1],BRD-IN-ID[0..1],DATA-REG-RD-LO,DATA-REG-WR-LO,DATA-REG-RD-HI,DATA-REG-WR-HI,ALU[0..3],ALU-FUNC,LD-AC,RD-AC,AC-IN-INV,BR-REG-LD-LO,I/D-REG-LD,I/D-REG-OUT,BR-REG-LD-HI,BR-REG-OUT,BR-COND,MEM-WR,MEM-RD,I/O-WR,I/O-RD,IO-ADDR,INT,SP/PC-SEL,SP/PC-DATA-OUT-LO,SP/PC-DATA-OUT-HI,SP/PC-ADDR-OUT,SP/PC-LD-LO,SP/PC-LD-HI,SP/PC-DN,SP/PC-UP,INT-ACK

## Sheet 10 of 10: unused
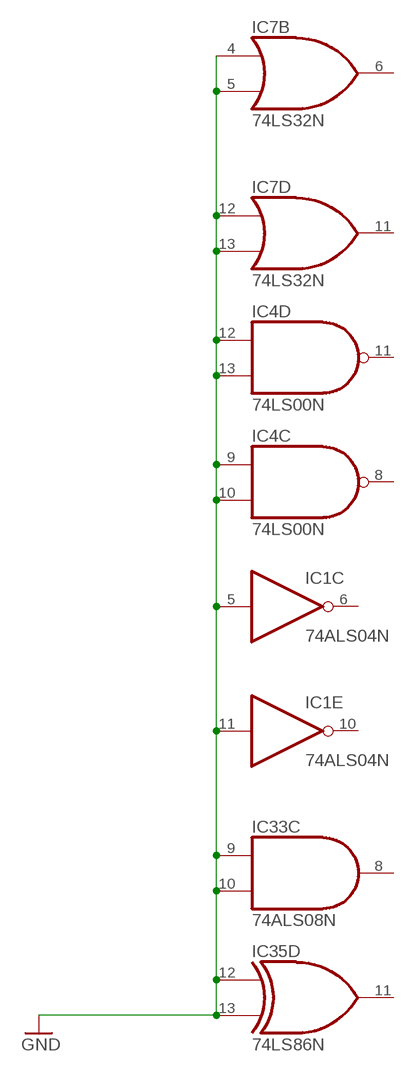
[diagram p9: schematic, sheet 10]

### Nets
GND: IC1.5(C:I) IC1.11(E:I) IC4.9(C:I0) IC4.10(C:I1) IC4.12(D:I0) IC4.13(D:I1) IC7.4(B:I0) IC7.5(B:I1) IC7.12(D:I0) IC7.13(D:I1) IC33.9(C:I0) IC33.10(C:I1) IC35.12(D:I0) IC35.13(D:I1) ; also sheet 1,2,5,6,7,9
Unconnected: IC1.6(C:O) IC1.10(E:O) IC4.8(C:O) IC4.11(D:O) IC7.6(B:O) IC7.11(D:O) IC33.8(C:O) IC35.11(D:O)

## Power pins joined to a net without a drawn wire
GND: IC1.7(P:GND) IC2.10(P:GND) IC3.10(P:GND) IC4.7(P:GND) IC5.8(GND) IC6.10(GND) IC7.7(P:GND) IC8.7(P:GND) IC9.7(P:GND) IC10.8(GND) IC11.8(GND) IC12.8(GND) IC13.8(GND) IC14.10(P:GND) IC15.10(P:GND) IC17.10(GND) IC18.10(GND) IC19.10(P:GND) IC20.10(P:GND) IC21.7(P:GND) IC22.7(P:GND) IC23.10(P:GND) IC24.10(P:GND) IC25.7(P:GND) IC26.7(P:GND) IC27.10(P:GND) IC28.7(P:GND) IC29.7(P:GND) IC30.10(P:GND) IC31.8(GND) IC32.8(GND) IC33.7(P:GND) IC34.8(GND) IC35.7(P:GND) IC36.8(GND) IC37.8(GND) IC38.8(GND) IC39.10(P:GND) IC40.8(GND) IC41.7(P:GND) IC42.7(P:GND) IC43.8(GND) IC44.8(GND) IC45.10(P:GND)
VCC: IC1.14(P:VCC) IC2.20(P:VCC) IC3.20(P:VCC) IC4.14(P:VCC) IC5.16(VCC) IC6.20(VCC) IC7.14(P:VCC) IC8.14(P:VCC) IC9.14(P:VCC) IC10.16(VCC) IC11.16(VCC) IC12.16(VCC) IC13.16(VCC) IC14.20(P:VCC) IC15.20(P:VCC) IC17.20(VCC) IC18.20(VCC) IC19.20(P:VCC) IC20.20(P:VCC) IC21.14(P:VCC) IC22.14(P:VCC) IC23.20(P:VCC) IC24.20(P:VCC) IC25.14(P:VCC) IC26.14(P:VCC) IC27.20(P:VCC) IC28.14(P:VCC) IC29.14(P:VCC) IC30.20(P:VCC) IC31.16(VCC) IC32.16(VCC) IC33.14(P:VCC) IC34.16(VCC) IC35.14(P:VCC) IC36.16(VCC) IC37.16(VCC) IC38.16(VCC) IC39.20(P:VCC) IC40.16(VCC) IC41.14(P:VCC) IC42.14(P:VCC) IC43.16(VCC) IC44.16(VCC) IC45.20(P:VCC)

## Library data of the parts
C1-C8 C10-C47 = rcl:C-US: CAPACITOR, American symbol
IC1 IC9 = 74xx-us:74*04: Hex INVERTER
IC2 = 74xx-us:74*240: Octal BUFFER and LINE DRIVER, 3-state
IC3 IC14 IC15 IC19 IC20 IC23 IC24 IC27 IC30 IC39 IC45 = 74xx-us:74*244: Octal BUFFER and LINE DRIVER, 3-state
IC4 = 74xx-us:74*00: Quad 2-input NAND gate
IC5 = 74xx-us:74*138: 3-line to 8-line DECODER/DEMULTIPLEXER
IC6 = 74xx-us:74*374: Octal D type transparent LATCH, edge triggered
IC7 IC28 IC29 = 74xx-us:74*32: Quad 2-input OR gate
IC8 = 74xx-us:74*74: Dual D type positive edge triggered FLIP FLOP, preset and clear
IC10-IC13 = 74xx-us:74*192: Synchronous 4-bit UP/DOWN COUNTER
IC17 IC18 = 74xx-us:74*245: Octal BUS TRANSCEIVER, 3-state
IC21 IC22 IC35 IC41 IC42 = 74xx-us:74*86: Quad 2-input EXCLUSIV-OR (XOR) gate
IC25 IC26 IC33 = 74xx-us:74*08: Quad 2-input AND gate
IC31 IC32 = 74xx-us:74*85: 4-bit magnitude COMPARATOR
IC34 = 74xx-us:74*251: 1 of 8 data SELECTOR/MULTIPLEXER, 3-state
IC36 IC40 = 74xx-us:74*153: Dual 4-line to 1-line data SELECTOR/MULTIPLEXER
IC37 IC38 = 74xx-us:74*194: 4-bit bidirectional SHIFT REGISTER
IC43 IC44 = 74xx-us:74*283: 4-bit binary FULL ADDER, fast carry
LED1 = led:LED: LED OSRAM: - CHIPLED LG R971, LG N971, LY N971, LG Q971, LY Q971, LO R971, LY R971 LH N974, LH R974 LS Q976, LO Q976, LY Q976 LO Q996 - Hyper CHIPLED LW Q18S LB Q993, LB Q99A, LB R99A - SideLED LS A670, LO A670, LY A670, LG A670, LP A670 LB A673, LV A673, LT A673, LW A673 LH A674 LY A675 LS A676, LA A676, LO A676, LY A676, LW A676 LS A679, LY A679, LG A679 - Hyper Micro SIDELED® LS Y876, LA Y876, LO Y876, LY Y876 LT Y87S - SmartLED LW L88C, LW L88S LB L89C, LB L89S, LG L890 LS L89K, LO L89K, LY L89K LS L896, LA L896, LO L896, LY L896 - TOPLED LS T670, LO T670, LY T670, LG T670, LP T670 LSG T670, LSP T670, LSY T670, LOP T670, LYG T670 LG T671, LOG T671, LSG T671 LB T673, LV T673, LT T673, LW T673 LH T674 LS T676, LA T676, LO T676, LY T676, LB T676, LH T676, LSB T676, LW T676 LB T67C, LV T67C, LT T67C, LS T67K, LO T67K, LY T67K, LW E67C LS E67B, LA E67B, LO E67B, LY E67B, LB E67C, LV E67C, LT E67C LW T67C LS T679, LY T679, LG T679 LS T770, LO T770, LY T770, LG T770, LP T770 LB T773, LV T773, LT T773, LW T773 LH T774 LS E675, LA E675, LY E675, LS T675 LS T776, LA T776, LO T776, LY T776, LB T776 LHGB T686 LT T68C, LB T68C - Hyper Mini TOPLED® LB M676 - Mini TOPLED Santana® LG M470 LS M47K, LO M47K, LY M47K Source: http://www.osram.convergy.de LUXEON: - LUMILED® LXK2-PW12-R00, LXK2-PW12-S00, LXK2-PW14-U00, LXK2-PW14-V00 LXK2-PM12-R00, LXK2-PM12-S00, LXK2-PM14-U00 LXK2-PE12-Q00, LXK2-PE12-R00, LXK2-PE12-S00, LXK2-PE14-T00, LXK2-PE14-U00 LXK2-PB12-K00, LXK2-PB12-L00, LXK2-PB12-M00, LXK2-PB14-N00, LXK2-PB14-P00, LXK2-PB14-Q00 LXK2-PR12-L00, LXK2-PR12-M00, LXK2-PR14-Q00, LXK2-PR14-R00 LXK2-PD12-Q00, LXK2-PD12-R00, LXK2-PD12-S00 LXK2-PH12-R00, LXK2-PH12-S00 LXK2-PL12-P00, LXK2-PL12-Q00, LXK2-PL12-R00 Source: www.luxeon.com KINGBRIGHT: KA-3528ASYC Source: www.kingbright.com
R1 = eagle-ltspice:R: RESISTOR, European symbol; SPICEMODEL: NONE; SPICEPREFIX: R
RN1 RN2 = resistor-net:RNX8: RESISTOR NETWORK; OC_FARNELL: unknown; OC_NEWARK: unknown
SV1 = con-lstb:MA05-2: PIN HEADER; OC_FARNELL: unknown; OC_NEWARK: unknown
V1 V2 = 74ttl-din:74*4078: 8-input OR/NOR, complementary outputs
X1 = con-vg:FABC96R: CONNECTOR female, 96 pins, type R, rows ABC, grid 2.54 mm